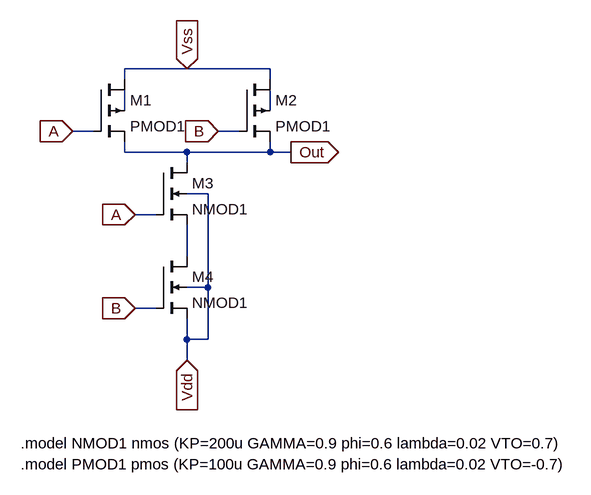
[diagram p0: schematic CMOS_NAND.asc]
CMOS_NAND.asc, the LTspice schematic file:
Version 4
SHEET 1 880 680
WIRE 144 32 48 32
WIRE 272 32 144 32
WIRE 48 48 48 32
WIRE 272 48 272 32
WIRE 48 96 48 64
WIRE 272 96 272 64
WIRE 0 128 -32 128
WIRE 224 128 192 128
WIRE 48 160 48 144
WIRE 144 160 48 160
WIRE 272 160 272 144
WIRE 272 160 144 160
WIRE 304 160 272 160
WIRE 144 176 144 160
WIRE 176 224 144 224
WIRE 96 256 64 256
WIRE 144 320 144 272
WIRE 176 368 176 224
WIRE 176 368 144 368
WIRE 96 400 64 400
WIRE 144 448 144 416
WIRE 176 448 176 368
WIRE 176 448 144 448
WIRE 144 480 144 448
FLAG 144 32 Vss
IOPIN 144 32 In
FLAG 144 480 Vdd
IOPIN 144 480 In
FLAG -32 128 A
IOPIN -32 128 In
FLAG 64 256 A
IOPIN 64 256 In
FLAG 192 128 B
IOPIN 192 128 In
FLAG 64 400 B
IOPIN 64 400 In
FLAG 304 160 Out
IOPIN 304 160 Out
SYMBOL nmos4 96 176 R0
SYMATTR InstName M3
SYMATTR Value NMOD1
SYMATTR Value2 l=1u w=50u
SYMBOL nmos4 96 320 R0
SYMATTR InstName M4
SYMATTR Value NMOD1
SYMATTR Value2 l=1u w=50u
SYMBOL pmos4 0 48 R0
SYMATTR InstName M1
SYMATTR Value PMOD1
SYMATTR Value2 l=1u w=50u
SYMBOL pmos4 224 48 R0
SYMATTR InstName M2
SYMATTR Value PMOD1
SYMATTR Value2 l=1u w=50u
TEXT -112 640 Left 2 !.model PMOD1 pmos (KP=100u GAMMA=0.9 phi=0.6 lambda=0.02 VTO=-0.7)
TEXT -112 608 Left 2 !.model NMOD1 nmos (KP=200u GAMMA=0.9 phi=0.6 lambda=0.02 VTO=0.7)

The netlist it stands for:
* CMOS_NAND.asc
M3 Out A N003 Vdd NMOD1 l=1u w=50u
M4 N003 B Vdd Vdd NMOD1 l=1u w=50u
M1 Vss A Out N001 PMOD1 l=1u w=50u
M2 Vss B Out N002 PMOD1 l=1u w=50u
.model NMOS NMOS
.model PMOS PMOS
.lib standard.mos
.model PMOD1 pmos (KP=100u GAMMA=0.9 phi=0.6 lambda=0.02 VTO=-0.7)
.model NMOD1 nmos (KP=200u GAMMA=0.9 phi=0.6 lambda=0.02 VTO=0.7)
.backanno
.end